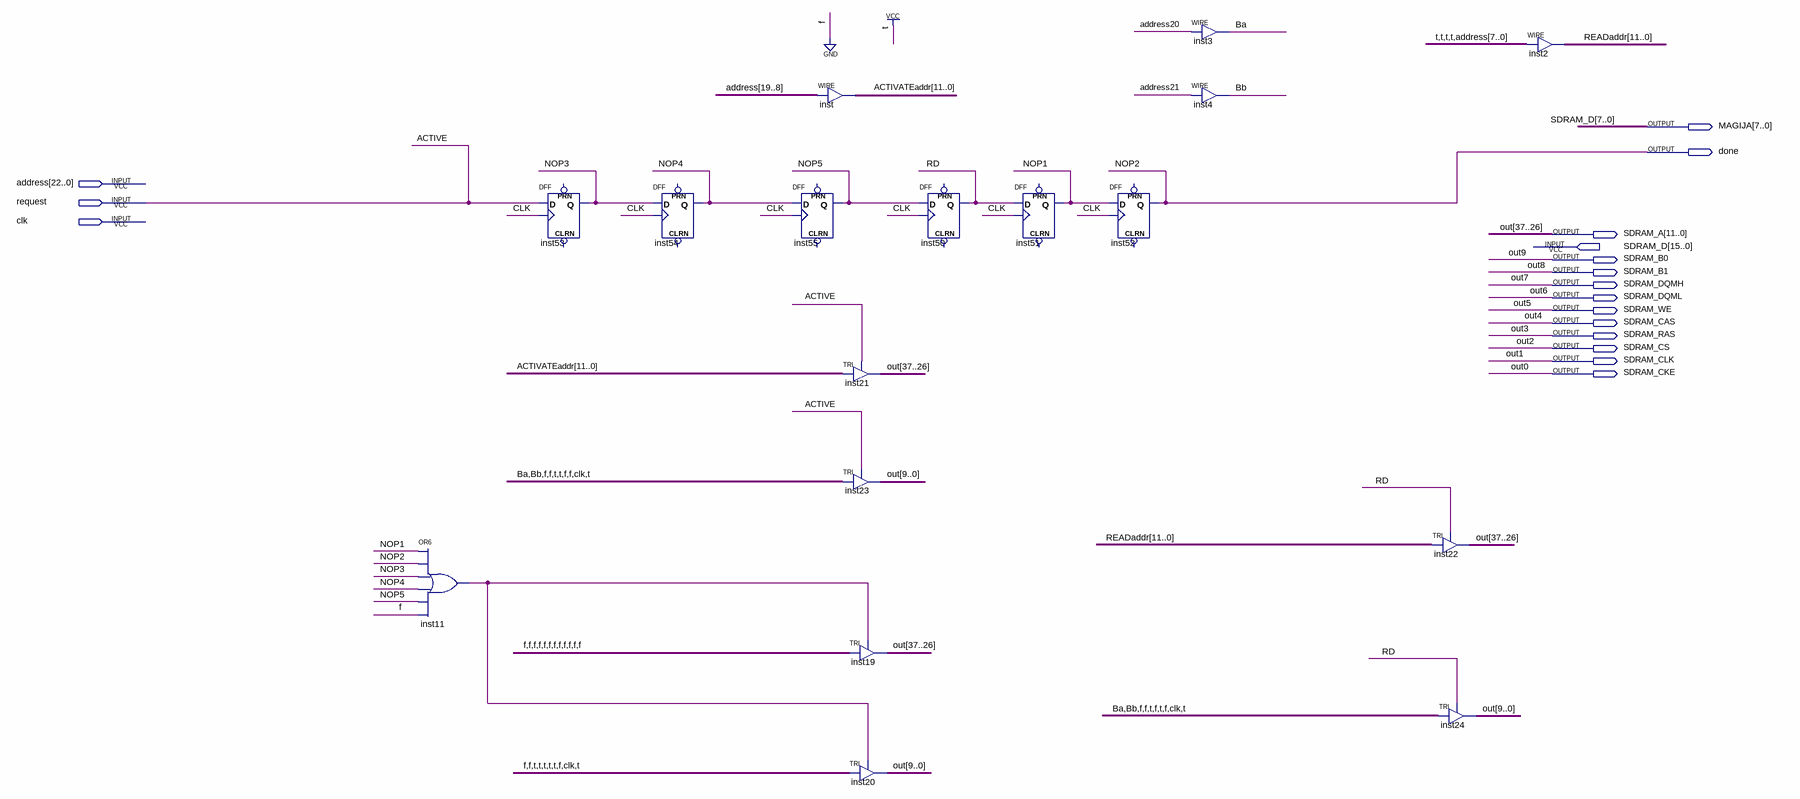
[diagram p0: schematic sheet]
// Quartus schematic ReadSDRAM.bdf as structural Verilog: 17 symbols, 17 pins
module ReadSDRAM (
  input  [22:0] address,
  input  request,
  input  clk,
  input  [15:0] SDRAM_D,
  output [7:0] MAGIJA,
  output done,
  output [11:0] SDRAM_A,
  output SDRAM_B0,
  output SDRAM_B1,
  output SDRAM_DQMH,
  output SDRAM_DQML,
  output SDRAM_WE,
  output SDRAM_CAS,
  output SDRAM_RAS,
  output SDRAM_CS,
  output SDRAM_CLK,
  output SDRAM_CKE
);

  wire Ba, Bb, inst11_out, NOP1, NOP3, NOP4, NOP5, RD;
  wire [11:0] ACTIVATEaddr, READaddr;

  or inst11 (inst11_out, NOP1, done, NOP3, NOP4, NOP5, 1'b0);
  DFF inst53 (.CLK(clk), .D(request), .Q(NOP3));  // open: CLRN, PRN
  DFF inst54 (.CLK(clk), .D(NOP3), .Q(NOP4));  // open: CLRN, PRN
  DFF inst55 (.CLK(clk), .D(NOP4), .Q(NOP5));  // open: CLRN, PRN
  assign ACTIVATEaddr = address[19:8];  // WIRE inst
  TRI inst21[11:0] (.IN(ACTIVATEaddr), .OE(request), .OUT(SDRAM_A));
  TRI inst23[9:0] (
    .IN({Ba, Bb, 6'b001100, clk, 1'b1}), .OE(request),
    .OUT({SDRAM_B0, SDRAM_B1, SDRAM_DQMH, SDRAM_DQML, SDRAM_WE, SDRAM_CAS, SDRAM_RAS, SDRAM_CS, SDRAM_CLK, SDRAM_CKE}));
  TRI inst19[11:0] (.IN({12{1'b0}}), .OE(inst11_out), .OUT(SDRAM_A));
  TRI inst20[9:0] (
    .IN({8'b00111110, clk, 1'b1}), .OE(inst11_out),
    .OUT({SDRAM_B0, SDRAM_B1, SDRAM_DQMH, SDRAM_DQML, SDRAM_WE, SDRAM_CAS, SDRAM_RAS, SDRAM_CS, SDRAM_CLK, SDRAM_CKE}));
  DFF inst50 (.CLK(clk), .D(NOP5), .Q(RD));  // open: CLRN, PRN
  DFF inst51 (.CLK(clk), .D(RD), .Q(NOP1));  // open: CLRN, PRN
  DFF inst52 (.CLK(clk), .D(NOP1), .Q(done));  // open: CLRN, PRN
  assign Ba = address[20];  // WIRE inst3
  assign Bb = address[21];  // WIRE inst4
  TRI inst22[11:0] (.IN(READaddr), .OE(RD), .OUT(SDRAM_A));
  TRI inst24[9:0] (
    .IN({Ba, Bb, 6'b001010, clk, 1'b1}), .OE(RD),
    .OUT({SDRAM_B0, SDRAM_B1, SDRAM_DQMH, SDRAM_DQML, SDRAM_WE, SDRAM_CAS, SDRAM_RAS, SDRAM_CS, SDRAM_CLK, SDRAM_CKE}));
  assign READaddr = {4'b1111, address[7:0]};  // WIRE inst2

  assign MAGIJA = SDRAM_D[7:0];

  // Other names for the same wires on the sheet: ACTIVE = request; NOP2 = done;
  //   out (some bits) = {SDRAM_A, SDRAM_B0, SDRAM_B1, SDRAM_DQMH, SDRAM_DQML, SDRAM_WE, SDRAM_CAS, SDRAM_RAS, SDRAM_CS, SDRAM_CLK, SDRAM_CKE};
  //   out0 = SDRAM_CKE; out1 = SDRAM_CLK; out2 = SDRAM_CS; out3 = SDRAM_RAS; out4 = SDRAM_CAS; out5 = SDRAM_WE;
  //   out6 = SDRAM_DQML; out7 = SDRAM_DQMH; out8 = SDRAM_B1; out9 = SDRAM_B0
endmodule
